# EAGLE design ESPRemote (EAGLE 9.5.2)
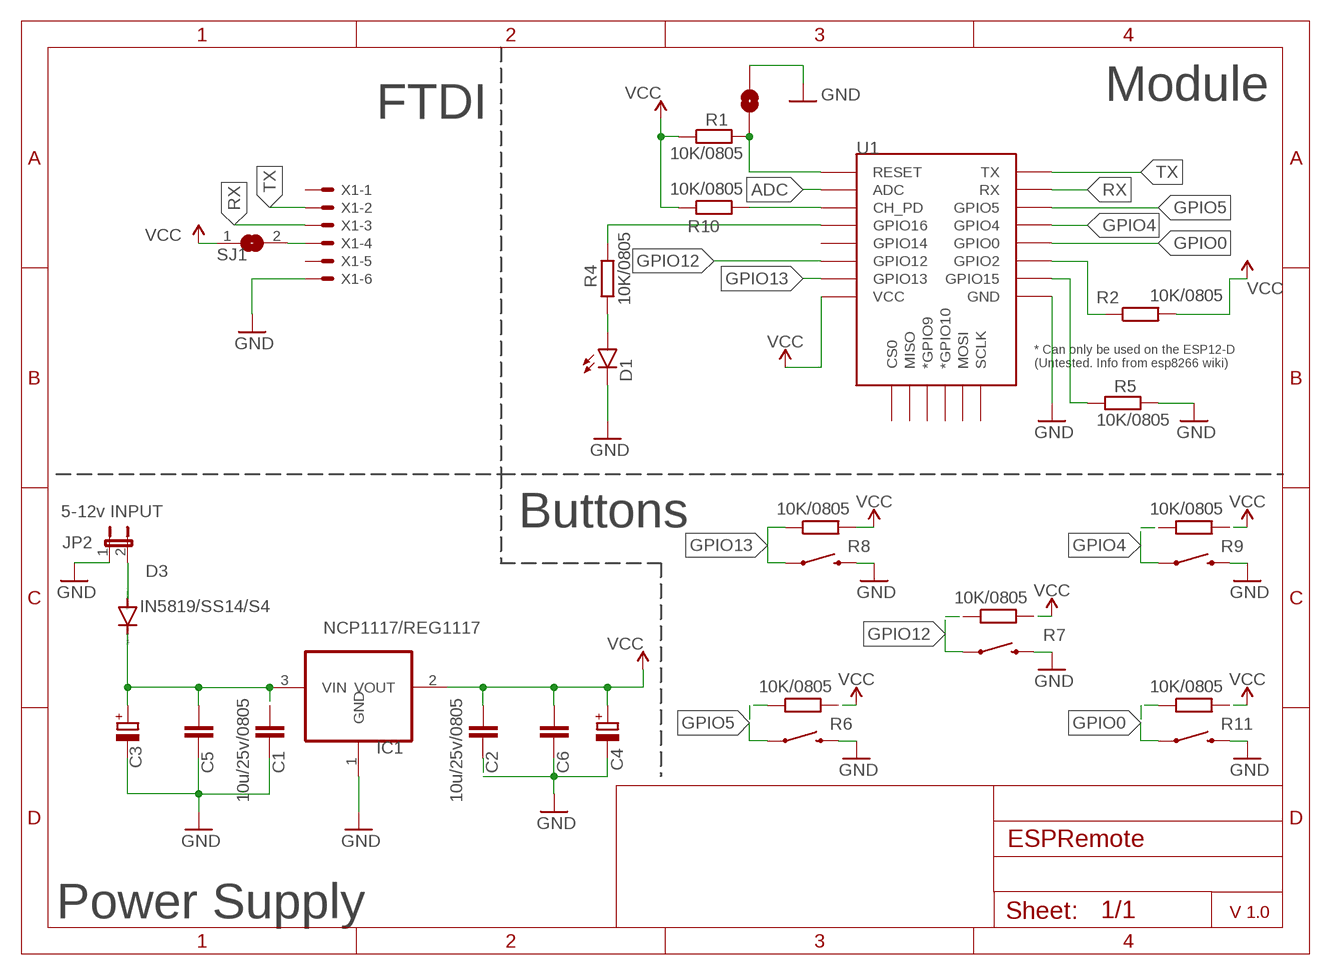
[diagram p0: schematic, sheet 1]

## Parts
C1  10u/25v/0805  C-EUC0805  [C0805]
C2  10u/25v/0805  C-EUC0805  [C0805]
C3  CPOL-EUE2-5  [E2-5]
C4  CPOL-EUE2-5  [E2-5]
C5  10u/25v/0805  C-EUC0805  [C0805]
C6  10u/25v/0805  C-EUC0805  [C0805]
D1  BLUE  LEDCHIP-LED0805  [CHIP-LED0805]
D3  IN5819/SS14/S4  DIODE-DO-214AC  [DO-214AC]
IC1  NCP1117/REG1117  REG1117  [SOT223]
JP1  RST  JUMPER-SMT_2_NO_NO-SILK  [SMT-JUMPER_2_NO_NO-SILK]
JP2  5-12v INPUT  JP1E  [JP1]
R1  10K/0805  R-EU_R0805  [R0805]
R2  10K/0805  R-EU_R0805  [R0805]
R4  10K/0805  R-EU_R0805  [R0805]
R5  10K/0805  R-EU_R0805  [R0805]
R6  10K/0805  R-EU_R0805  [R0805]
R7  10K/0805  R-EU_R0805  [R0805]
R8  10K/0805  R-EU_R0805  [R0805]
R9  10K/0805  R-EU_R0805  [R0805]
R10  10K/0805  R-EU_R0805  [R0805]
R11  10K/0805  R-EU_R0805  [R0805]
S0  SMD-SWITCH-6.2MM  MOMENTARY-SWITCH-SPST-SMD-6.0X3.5MM  [TACTILE_SWITCH_SMD_6.0X3.5MM]
S1  SMD-SWITCH-6.2MM  MOMENTARY-SWITCH-SPST-SMD-6.0X3.5MM  [TACTILE_SWITCH_SMD_6.0X3.5MM]
S2  SMD-SWITCH-6.2MM  MOMENTARY-SWITCH-SPST-SMD-6.0X3.5MM  [TACTILE_SWITCH_SMD_6.0X3.5MM]
S3  SMD-SWITCH-6.2MM  MOMENTARY-SWITCH-SPST-SMD-6.0X3.5MM  [TACTILE_SWITCH_SMD_6.0X3.5MM]
S4  SMD-SWITCH-6.2MM  MOMENTARY-SWITCH-SPST-SMD-6.0X3.5MM  [TACTILE_SWITCH_SMD_6.0X3.5MM]
SJ1  SJ  [SJ]
U1  ESP12ESMD  [ESP12E-SMD]
X1  JST-XH-06-PIN-ROUND-PAD  [JST-XH-06-PACKAGE-ROUND-PAD]

## Nets
ADC: U1.ADC
GND: C1.1 C2.1 C3.- C4.- C5.1 C6.1 D1.C IC1.1(GND) JP1.2 JP2.1 R5.2 S0.2 S1.2 S2.2 S3.2 S4.2 U1.GND X1.6
GPIO0: R11.1 S4.1 U1.GPIO0
GPIO4: R9.1 S3.1 U1.GPIO4
GPIO5: R6.1 S2.1 U1.GPIO5
GPIO12: R7.1 S1.1 U1.GPIO12
GPIO13: R8.1 S0.1 U1.GPIO13
N$1: C1.2 C3.+ C5.2 D3.C IC1.3(VIN)
N$2: JP1.1 R1.2 U1.RESET
N$3: D3.A JP2.2
N$4: R10.2 U1.CH_PD
N$5: R2.1 U1.GPIO2
N$6: SJ1.2 X1.4
N$7: R5.1 U1.GPIO15
N$8: R4.2 U1.GPIO16
N$9: D1.A R4.1
RX: U1.RXD0(RX) X1.3
TX: U1.TXD0(TX) X1.2
VCC: C2.2 C4.+ C6.2 IC1.2(VOUT) R1.1 R2.2 R6.2 R7.2 R8.2 R9.2 R10.1 R11.2 SJ1.1 U1.VCC
Unconnected: U1.CS0 U1.GPIO9(*GPIO9) U1.GPIO10(*GPIO10) U1.GPIO14 U1.MISO U1.MOSI U1.SCLK X1.1 X1.5

## Notes on the sheet
- Module
- FTDI
- Buttons
- Power Supply | V 1.0

## Library data of the parts
C1 C2 C5 C6 = rcl:C-EU: CAPACITOR, European symbol; SPICEPREFIX: C
C3 C4 = rcl:CPOL-EU: POLARIZED CAPACITOR, European symbol; SPICEPREFIX: C
D1 = led:LED: LED OSRAM: - CHIPLED LG R971, LG N971, LY N971, LG Q971, LY Q971, LO R971, LY R971 LH N974, LH R974 LS Q976, LO Q976, LY Q976 LO Q996 - Hyper CHIPLED LW Q18S LB Q993, LB Q99A, LB R99A - SideLED LS A670, LO A670, LY A670, LG A670, LP A670 LB A673, LV A673, LT A673, LW A673 LH A674 LY A675 LS A676, LA A676, LO A676, LY A676, LW A676 LS A679, LY A679, LG A679 - Hyper Micro SIDELED® LS Y876, LA Y876, LO Y876, LY Y876 LT Y87S - SmartLED LW L88C, LW L88S LB L89C, LB L89S, LG L890 LS L89K, LO L89K, LY L89K LS L896, LA L896, LO L896, LY L896 - TOPLED LS T670, LO T670, LY T670, LG T670, LP T670 LSG T670, LSP T670, LSY T670, LOP T670, LYG T670 LG T671, LOG T671, LSG T671 LB T673, LV T673, LT T673, LW T673 LH T674 LS T676, LA T676, LO T676, LY T676, LB T676, LH T676, LSB T676, LW T676 LB T67C, LV T67C, LT T67C, LS T67K, LO T67K, LY T67K, LW E67C LS E67B, LA E67B, LO E67B, LY E67B, LB E67C, LV E67C, LT E67C LW T67C LS T679, LY T679, LG T679 LS T770, LO T770, LY T770, LG T770, LP T770 LB T773, LV T773, LT T773, LW T773 LH T774 LS E675, LA E675, LY E675, LS T675 LS T776, LA T776, LO T776, LY T776, LB T776 LHGB T686 LT T68C, LB T68C - Hyper Mini TOPLED® LB M676 - Mini TOPLED Santana® LG M470 LS M47K, LO M47K, LY M47K Source: http://www.osram.convergy.de LUXEON: - LUMILED® LXK2-PW12-R00, LXK2-PW12-S00, LXK2-PW14-U00, LXK2-PW14-V00 LXK2-PM12-R00, LXK2-PM12-S00, LXK2-PM14-U00 LXK2-PE12-Q00, LXK2-PE12-R00, LXK2-PE12-S00, LXK2-PE14-T00, LXK2-PE14-U00 LXK2-PB12-K00, LXK2-PB12-L00, LXK2-PB12-M00, LXK2-PB14-N00, LXK2-PB14-P00, LXK2-PB14-Q00 LXK2-PR12-L00, LXK2-PR12-M00, LXK2-PR14-Q00, LXK2-PR14-R00 LXK2-PD12-Q00, LXK2-PD12-R00, LXK2-PD12-S00 LXK2-PH12-R00, LXK2-PH12-S00 LXK2-PL12-P00, LXK2-PL12-Q00, LXK2-PL12-R00 Source: www.luxeon.com KINGBRIGHT: KA-3528ASYC Source: www.kingbright.com
D3 = diode:DIODE-: DIODE
IC1 = burr-brown:REG1117: 800mA and 1A Low Dropout (LDO) Positive Regulator 1.8V, 2.5V, 2.85V, 3.3V, 5V, and Adj; MPN: REG1117; OC_FARNELL: 1097566; OC_NEWARK: 14P6981
JP1 = SparkFun-Jumpers:JUMPER-SMT_2_NO: Normally open jumper This jumper has two pads in close proximity to each other. Apply solder to close the connection. Round pads are easier to solder for beginners, but are a lot larger. SparkFun Product that uses the round pads: SparkFun EL Sequencer <https://www.sparkfun.com/products/12781>
JP2 = jumper:JP1E: JUMPER
R1 R2 R4-R11 = rcl:R-EU_: RESISTOR, European symbol; SPICEPREFIX: R
S0 S1-S4 = SparkFun-Switches:MOMENTARY-SWITCH-SPST: Momentary Switch (Pushbutton) - SPST Normally-open (NO) SPST momentary switches (buttons, pushbuttons). Variants PTH-12MM - 12mm square, through-hole Momentary Pushbutton Switch - 12mm Square <https://www.sparkfun.com/products/9190> (COM-09190) PTH-6.0MM, PTH-6.0MM-KIT - 6.0mm square, through-hole Mini Pushbutton Switch <https://www.sparkfun.com/products/97> (COM-00097) KIT package intended for soldering kit's - only one side of pads' copper is exposed. PTH-RIGHT-ANGLE-KIT - Right-angle, through-hole Right Angle Tactile Button <https://www.sparkfun.com/products/10791> - Used on SparkFun BigTime Watch Kit <https://www.sparkfun.com/products/11734> SMD-12MM - 12mm square, surface-mount Tactile Button - SMD (12mm) <https://www.sparkfun.com/products/12993> (COM-12993) Used on SparkFun PicoBoard <https://www.sparkfun.com/products/11888> SMD-4.5MM - 4.5mm Square Trackball Switch Used on SparkFun Blackberry Trackballer Breakout <https://www.sparkfun.com/products/13169> SMD-4.6MMX2.8MM - 4.60mm x 2.80mm, surface mount Used on SparkFun SAMD21 Mini Breakout <https://www.sparkfun.com/products/13664> SMD-5.2MM, SMD-5.2-REDUNDANT - 5.2mm square, surface-mount Mini Pushbutton Switch - SMD <https://www.sparkfun.com/products/8720> (COM-08720) Used on Arduino Pro Mini <https://www.sparkfun.com/products/11114> REDUNDANT package connects both switch circuits together SMD-6.0X3.5MM - 6.0 x 3.5mm, surface mount Momentary Reset Switch SMD <https://www.sparkfun.com/products/8229> (COM-08229) SMD-6.2MM-TALL - 6.2mm square, surface mount Tactile Button - SMD (6mm) <https://www.sparkfun.com/products/12992> Used on SparkFun Digital Sandbox <https://www.sparkfun.com/products/12651> SMD-RIGHT-ANGLE - Right-angle, surface mount Used on SparkFun Block for Intel® Edison - Arduino <https://www.sparkfun.com/products/13036>; PROD_ID: SWCH-00815; SF_SKU: COM-08229
SJ1 = jumper:SJ: SMD solder JUMPER
U1 = esp8266modules:ESP12E: ESP12E Module; SPICEPREFIX: X
X1 = JST-XH:JST-XH-06-PIN: JST XH Connector 2 Pin Wire to board connector. Pitch: 2,54 mm, (0.100") Number of pins: 6 Created by Rembrandt Electronics www.rembrandtelectronics.com

## Board
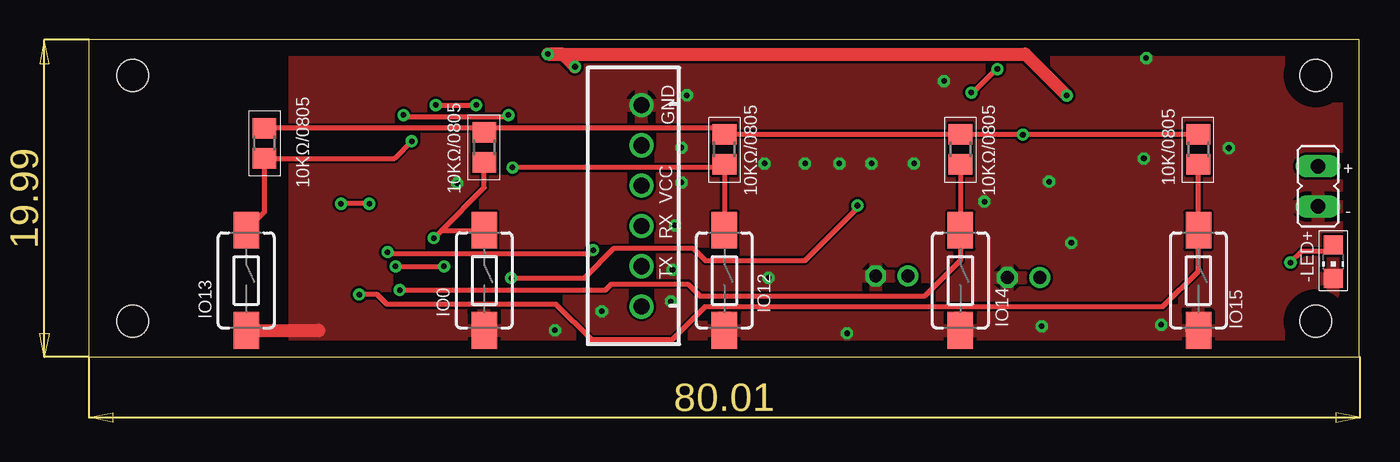
[diagram p1: board, top side]
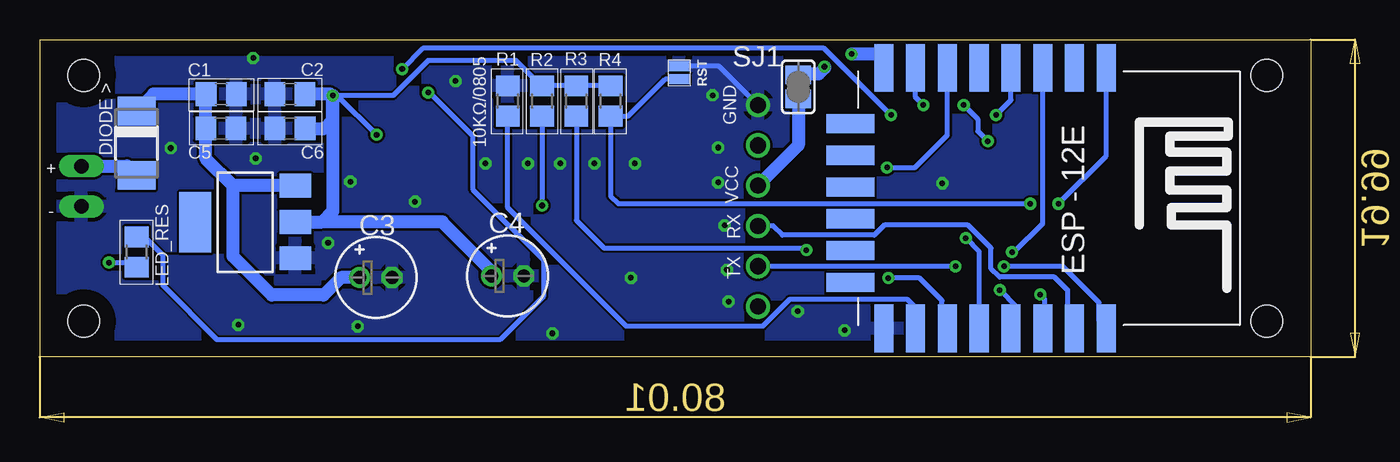
[diagram p2: board, bottom side, seen from below]

Size 79.99 x 19.99 mm. Coordinates in mm from the lower left corner, seen from the top.
Outline: 0,0 79.99,0 79.99,19.99 0,19.99 0,0
Copper layers (1*16): Top 0.035mm / dielectric 1.5mm / Bottom 0.035mm
Design rules "default": minimum track width 6mil, minimum drill 0.35mm, track to track 6mil, track to pad 6mil, pad to pad 6mil, via to via 6mil, smd to smd 6mil, copper to edge 40mil, drill to drill 6mil, minimum pad ring 10mil, minimum via ring 8mil, stop-mask expansion 4mil, vias tented up to drill 0mil, thermal gap 10mil
Holes 2 mm at 2.76,17.75 2.76,2.25 77.24,2.25 77.24,17.75

### Footprints (pad centres in the part's own frame; a part is rotated, then mirrored left to right if it is on the bottom)
C0805 = smd 1.3 x 1.5: 1 -0.95,0; 2 0.95,0
E2-5 = drill 0.813 pad 1.27: + -1.016,0 | drill 0.813 pad 1.27 octagon: - 1.016,0
CHIP-LED0805 = smd 1.2 x 1.2: A 0,-1.05; C 0,1.05
DO-214AC = smd 1.8 x 2.4: A 2.025,0; C -2.025,0
SOT223 = smd 1.499 x 2.007: 1 -2.261,-3.15; 2 0.025,-3.15; 3 2.311,-3.15 | smd 3.81 x 2.007: 4 0,3.15
SMT-JUMPER_2_NO_NO-SILK = smd 0.635 x 1.27: 1 -0.406,0; 2 0.406,0
JP1 = drill 0.914 long: 1 0,-1.27; 2 0,1.27
R0805 = smd 1.3 x 1.5: 1 -0.95,0; 2 0.95,0
TACTILE_SWITCH_SMD_6.0X3.5MM = smd 2.3 x 1.6: 1 -3.15,0; 2 3.15,0
SJ = smd 1.168 x 1.6: 1 -0.762,0; 2 0.762,0
ESP12E-SMD = smd 3 x 1.2: ADC -8.3,3.8; CH_PD -8.3,1.8; GND 8.1,-8.2; GPIO0 8.1,-2.2; GPIO2 8.1,-4.2; GPIO4 8.1,-0.2; GPIO5 8.1,1.8; GPIO12 -8.3,-4.2; GPIO13 -8.3,-6.2; GPIO14 -8.3,-2.2; GPIO15 8.1,-6.2; GPIO16 -8.3,-0.2; RESET -8.3,5.8; RXD0 8.1,3.8; TXD0 8.1,5.8; VCC -8.3,-8.2 | smd 1.2 x 3: CS0 -4.8,-10.3; GPIO9 -0.8,-10.3; GPIO10 1.2,-10.3; MISO -2.8,-10.3; MOSI 3.2,-10.3; SCLK 5.2,-10.3
JST-XH-06-PACKAGE-ROUND-PAD = drill 1.016: 1 -6.35,0; 2 -3.81,0; 3 -1.27,0; 4 1.27,0; 5 3.81,0; 6 6.35,0

### Placement (x,y rotation side)
C1  68.58,16.56 180 bottom
C2  64.26,16.56 0 bottom
C3  58.85,5 0 bottom
C4  50.55,5.1 0 bottom
C5  68.6,14.4 180 bottom
C6  64.25,14.4 0 bottom
D1  78.34,6.01 180 top
D3  73.91,13.46 270 bottom
IC1  67.06,8.48 90 bottom
JP1  39.75,17.91 90 bottom
JP2  77.39,10.76 0 top
R1  44.07,16.13 270 bottom
R2  48.39,16.13 90 bottom
R4  73.91,6.61 90 bottom
R5  50.55,16.13 90 bottom
R6  69.85,13.08 90 top
R7  40.01,13.08 90 top
R8  11.05,13.46 90 top
R9  54.86,13.08 90 top
R10  46.23,16.13 270 bottom
R11  24.89,13.21 90 top
S0  9.91,4.83 270 top
S1  40.01,4.83 270 top
S2  69.85,4.83 270 top
S3  54.86,4.83 270 top
S4  24.89,4.83 270 top
SJ1  32.26,17.02 270 bottom
U1  18.67,9.91 270 bottom
X1  34.8,9.53 90 top

### Tracks (layer width: path | path; a pad name or v marks a point on that pad's centre or on a via)
GND  (via drill 0.35)
  Top 0.61: S2.2 69.32,1.68
  Top 0.813: S0.2 14.45,1.68 14.48,1.65
  Bottom 0.305: X1.6 37.24,18.31 JP1.2
  Bottom 0.813: 65.2,16.55 C2.1 | 67.65,16.54 C1.1
  other vias: 66.56,18.83 29.34,1.68 71.76,13.16 60.45,11.05 53.84,17.39 61.85,7.18 42.55,12.19 45.09,12.19 47.24,12.19 49.28,12.19 51.94,12.19 67.5,2.03 56.39,9.79 59.99,1.94 47.74,1.49 66.41,12.51 36.65,3.49 36.9,8.29 36.74,5.49 37.3,10.99 37.3,13.19 37.65,16.49 32.29,2.88 23.2,10.94 42.8,4.99
  pour Bottom: 12.45,20.45 12.45,0.64 13.59,-0.51 78.87,-0.51 80.77,1.4 80.77,18.16 78.36,20.57 12.57,20.57
  pour Top: 12.95,20.7 12.95,0.13 13.72,-0.64 78.99,-0.64 81.03,1.4 81.03,17.78 78.36,20.45 13.21,20.45
GPIO0  (via drill 0.35)
  Top 0.305: v21.72,7.49 22.2,7.98 | 22.2,7.98 S4.1 | 22.2,7.98 24.89,10.67 R11.1
  Bottom 0.305: v21.72,7.49 20.87,6.64 U1.GPIO0
GPIO4  (via drill 0.35)
  Top 0.305: R9.1 S3.1 54.86,6.07 52.62,3.83 38.48,3.83 37.71,4.6 32.9,4.6 32.51,4.21 v19.58,4.21
  Bottom 0.305: v19.58,4.21 18.54,3.18 18.54,2.13 U1.GPIO4
GPIO5  (via drill 0.35)
  Top 0.305: v17.02,3.94 18.15,3.94 18.77,3.33 29.42,3.33 31.67,1.07 36.72,1.07 38.82,3.17 67.63,3.17 69.85,5.4 S2.1 R6.1
  Bottom 0.305: v17.02,3.94 16.76,3.68 16.76,1.91 U1.GPIO5
GPIO12  (via drill 0.35)
  Top 0.305: S1.1 R7.1 39.73,11.94 v26.67,11.94
  Bottom 0.305: v26.67,11.94 24.91,11.94 22.87,13.97 U1.GPIO12
GPIO13  (via drill 0.35)
  Top 0.305: S0.1 11.05,9.12 R8.1 19.24,12.51 v20.32,13.59 | v21.84,15.88 v24.38,15.88
  Bottom 0.305: v21.84,15.88 20.95,14.99 20.95,14.22 v20.32,13.59 | v24.38,15.88 24.87,16.36 U1.GPIO13
N$1
  Bottom 0.813: IC1.3 67.84,10.79 | D3.C 72.84,16.56 C1.2 69.55,16.54 C5.2 69.55,12.5 67.84,10.79 | 67.84,10.79 67.84,6.34 65.4,3.9 62.15,3.9 61.05,5 C3.+
N$2  (via drill 0.35)
  Top 0.305: v17.65,9.65 v15.88,9.65
  Bottom 0.305: JP1.1 40.64,17.5 42.96,15.18 R1.2 44.07,10.13 43.59,9.65 v17.65,9.65 | v15.88,9.65 12.87,12.66 U1.RESET
N$3
  Bottom 0.813: D3.A 74.51,12.04 77.38,12.04 JP2.2
N$4  (via drill 0.35)
  Top 0.305: v31.75,6.73 31.5,6.48 18.92,6.48 v18.8,6.6
  Bottom 0.305: R10.2 46.23,8.61 44.48,6.86 31.88,6.86 v31.75,6.73 | v18.8,6.6 18.67,6.6 16.87,8.4 U1.CH_PD
N$5  (via drill 0.35)
  Top 0.305: v26.59,4.97 31.19,4.97 33.04,6.82 38.07,6.82 38.82,6.07 45.07,6.07 48.39,9.39 v48.39,9.54
  Bottom 0.305: U1.GPIO2 23.2,2.14 23.2,3.56 24.61,4.97 v26.59,4.97 | R2.1 v48.39,9.54
N$6
  Bottom 0.813: SJ1.2 32.26,13.34 X1.4
N$7
  Bottom 0.305: U1.GPIO15 24.82,1.85 24.82,3.05 25.38,3.61 32.83,3.61 34.5,1.93 43.07,1.93 50.55,9.41 R5.1
N$8  (via drill 0.35)
  Top 0.305: v26.42,15.24 26.29,15.11 19.94,15.11 v19.81,15.24 | v57.2,18.14 57.15,18.14 55.66,16.66 v55.55,16.66
  Bottom 0.305: v26.42,15.24 26.43,15.24 30.64,19.44 55.89,19.44 v57.2,18.14 | v19.81,15.24 18.87,16.18 U1.GPIO16 | R4.2 73.41,7.56 72.25,6.4 72.25,4.5 68.84,1.09 51.04,1.09 48.3,3.83 48.3,6.1 52.75,10.55 52.75,13.95 55.46,16.66 v55.55,16.66
N$9  (via drill 0.35)
  Top 0.152: D1.A 77.93,6.65
  Top 0.305: 77.93,6.65 76.35,6.65 v75.65,5.95
  Bottom 0.152: 74.2,5.95 R4.1
  Bottom 0.305: v75.65,5.95 74.2,5.95
RX
  Bottom 0.305: U1.RXD0 15.29,2.23 15.29,4.2 16.13,5.03 19.59,5.03 20.11,5.56 20.11,6.86 21.56,8.3 26.84,8.3 27.47,7.67 33.26,7.67 33.84,8.26 X1.3
TX  (via drill 0.35)
  Top 0.305: v19.3,5.71 v22.35,5.71
  Bottom 0.305: U1.TXD0 13.33,2.27 13.33,3.43 15.61,5.71 v19.3,5.71 | v22.35,5.71 X1.2
VCC  (via drill 0.35)
  Top 0.305: R8.2 24.76,14.41 24.77,14.25 24.79,14.26 R11.2 24.94,14.43 40.08,14.43 40.01,14.42 R7.2 R9.2 58.8,14.03 v58.8,13.99 58.8,14.03 R6.2
  Top 0.813: v61.56,16.47 58.94,19.09 v28.89,19.09 29.81,19.09 v30.61,18.29
  Bottom 0.305: R1.1 R10.1 48.38,17.08 48.39,17.04 | 48.39,17.04 R2.2 | 48.39,17.04 50.01,18.67 55.56,18.67 57.76,16.47 v61.56,16.47 61.28,16.47 v58.8,13.99
  Bottom 0.813: IC1.2 62.24,8.51 | 62.24,8.51 61.56,9.19 v61.56,16.47 | U1.VCC 26.84,18.23 26.84,19.09 v28.89,19.09 | v61.56,16.47 61.66,16.47 61.75,16.56 C2.2 | v30.61,18.29 30.61,18.2 30.97,17.83 32.2,17.83 SJ1.1 | C6.2 62.08,14.4 61.56,14.92 v61.56,16.47 | 62.24,8.51 54.67,8.51 51.57,5.4 C4.+

### Text on the board
tPlace: GND | 10KΩ/0805 | 10KΩ/0805 | 10KΩ/0805 | 10KΩ/0805 | VCC | + | - | RX | TX | -LED+ | IO0 | IO12 | IO13 | IO14 | IO15
bPlace: R4 | R3 | R2 | R1 | 10KΩ/0805 | GND | DIODE > | VCC | + | - | RX | TX | LED_RES